# Altium schematic sheet Gate Driver.SchDoc
size A4; Author: Esteban Durán Madrid; CompanyName: Universidad de Santiago de Chile; Address1: Avenida Ecuador Nº 3519; Address2: Estación Central, Santiago; Address3: Chile
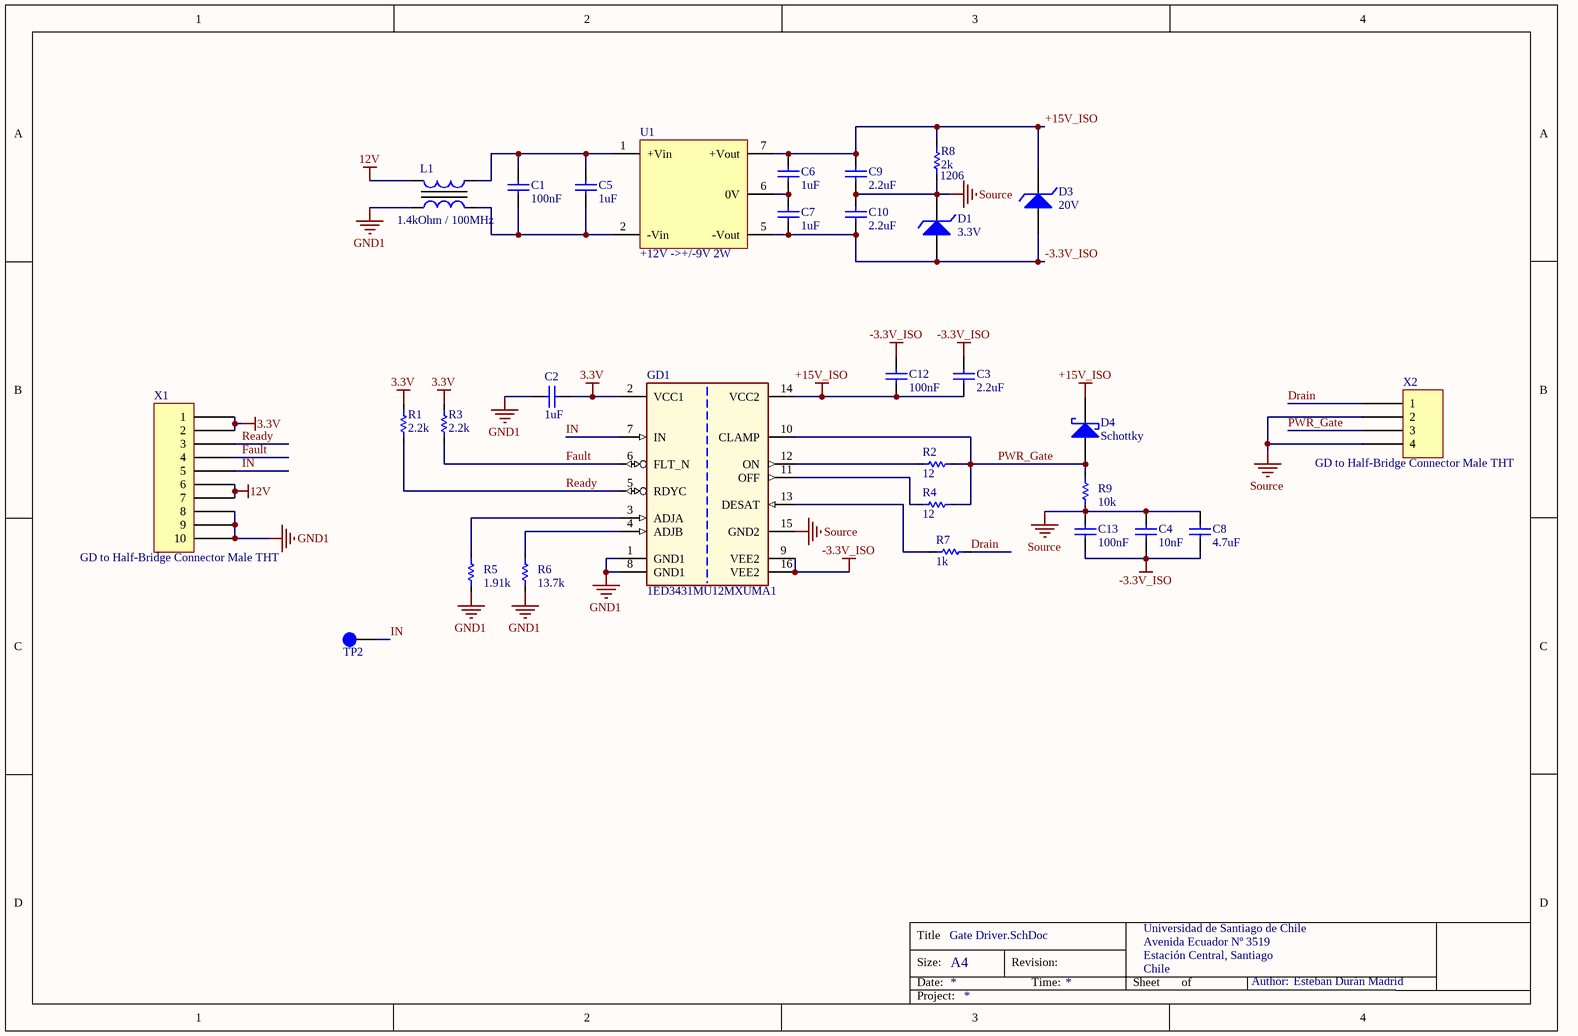
[diagram p0: Gate Driver.SchDoc]

## Parts
C1  100nF  [CAP_0603]
C2  1uF  [CAP_0805]
C3  2.2uF  [CAP_0805]
C4  10nF  [CAP_0603]
C5  1uF  [CAP_0805]
C6  1uF  [CAP_0805]
C7  1uF  [CAP_0805]
C8  4.7uF  [CAP_0805]
C9  2.2uF  [CAP_0805]
C10  2.2uF  [CAP_0805]
C12  100nF  [CAP_0603]
C13  100nF  [CAP_0603]
D1  3.3V  [SOD-123]
D3  20V  [SOD-123]
D4  Schottky  [SOD-123]
GD1  1ED3431MU12MXUMA1  [SOP65P1030X265-16N-1]
L1  1.4kOhm / 100MHz  [CHOKE_CM_4.7x4.5mm]
R1  2.2k  [RES_0603]
R2  12  [RES_MMB_0207]
R3  2.2k  [RES_0603]
R4  12  [RES_MMB_0207]
R5  1.91k  [RES_0603]
R6  13.7k  [RES_0603]
R7  1k  [RES_0603]
R8  2k  Package: 1206  [RES_1206]
R9  10k  [RES_0603]
TP2  Gate  [TP_1mm]  (value not drawn)  (no BOM)
U1  +12V ->+/-9V 2W  [DC//DC MEJ2D0509SC]
X1  GD to Half-Bridge Connector Male THT  [TMM-110-01-G-S]
X2  GD to Half-Bridge Connector Male THT  [TMM-104-01-G-S]

## Nets
3.3V: C2.1 GD1.2(VCC1) R1.2 R3.2 X1.1 X1.2
12V: L1.3 X1.6 X1.7
+15V_ISO: C3.2 C6.1 C9.1 C12.2 D3.K D4.K GD1.14(VCC2) R8.2 U1.7(+Vout)
-3.3V_ISO: C3.1 C4.2 C7.2 C8.2 C10.2 C12.1 C13.2 D1.A D3.A GD1.9(VEE2) GD1.16(VEE2) U1.5(-Vout)
GND1: C2.2 GD1.1(GND1) GD1.8(GND1) L1.4 R5.1 R6.1 X1.8 X1.9 X1.10
Source: C4.1 C8.1 C9.2 C10.1 C13.1 D1.K GD1.15(GND2) R8.1 R9.1 X2.2 X2.4
Drain: R7.2 X2.1
Fault: GD1.6(FLT_N) R3.1 X1.4
IN: GD1.7(IN) TP2.1 X1.5
PWR_Gate: D4.A GD1.10(CLAMP) R2.1 R4.1 R9.2 X2.3
Ready: GD1.5(RDYC) R1.1 X1.3
NetC1_1: C1.1 C5.2 L1.1 U1.2(-Vin)
NetC1_2: C1.2 C5.1 L1.2 U1.1(+Vin)
NetC6_2: C6.2 C7.1 U1.6(0V)
NetGD1_3: GD1.3(ADJA) R5.2
NetGD1_4: GD1.4(ADJB) R6.2
NetGD1_11: GD1.11(OFF) R4.2
NetGD1_12: GD1.12(ON) R2.2
NetGD1_13: GD1.13(DESAT) R7.1

## Notes on the sheet
- Title
- Size:
- Date:
- A4
- Revision:
- Time:
- Sheet
- of
- Author:
- Project:

## Library data of the parts
C1 C12 C13 = Cap_0603: 0.1µF ±10% 50V Ceramic Capacitor X7R 0603 (1608 Metric); MF: KEMET; MFP: C0603C104K5RACTU; Created: 2020_06_15_DAarancibia; Package: 0603; Value: 100nF; Supplier 1: Digi-Key; Supplier Part Number 1: 399-5089-1-ND
C2 C5-C7 = Cap_0805: 0.1µF ±10% 50V Ceramic Capacitor X7R 0805 (2012 Metric); MF: KEMET; MFP: C0805C105K5RACTU; Created: 2020_06_15_DAarancibia; Package: 0805; Value: 1uF; Supplier 1: Digi-Key; Supplier Part Number 1: 399-7409-1-ND
C3 = Cap_0805: 0.1µF ±10% 50V Ceramic Capacitor X7R 0805 (2012 Metric); MF: Taiyo Yuden; MFP: TMK212B7225MGHT; Created: 2020_06_15_DAarancibia; Package: 0805; Value: 2.2uF; Supplier 1: Digi-Key; Supplier Part Number 1: 587-6358-1-ND
C4 = Cap_0603: ±10% 50V Ceramic Capacitor X7R 0603 (1608 Metric); MF: KEMET; MFP: C0603C103K5RACTU; Created: 2020_06_15_DAarancibia; Package: 0603; Value: 10nF; Supplier 1: Digi-Key; Supplier Part Number 1: 399-1091-1-ND
C8 = Cap_0805: 4.7 µF ±10% 50V Ceramic Capacitor X7R 0805 (2012 Metric); MF: Murata Electronics; MFP: GRM21BZ71H475KE15L; Created: 2020_06_15_DAarancibia; Package: 0805; Value: 4.7uF; Supplier 1: Digi-Key; Supplier Part Number 1: 490-GRM21BZ71H475KE15LCT-ND
C9 C10 = Cap_0805: 2.2µF ±10% 50V Ceramic Capacitor X7R 0805 (2012 Metric); MF: KEMET; MFP: UMK212BB7225KG-T; Created: 2020_06_15_DAarancibia; Package: 0805; Value: 2.2uF; Supplier 1: Digi-Key; Supplier Part Number 1: 587-3169-1-ND
D1 = Diode_Zener_3.3V: Zener Diode 3.3V 500mW ±5% Surface Mount SOD-123; MF: ON Semiconductor; MFP: MMSZ5226BT1G; Created: 2020_07_28_DAarancibia; Package: SOD-123; Value: 3.3V; Supplier 1: Digi-Key; Supplier Part Number 1: MMSZ5226BT1GOSCT-ND
D3 = Diode_Zener_20V: Zener Diode 20V 500mW ±5% Surface Mount SOD-123; MF: Micro Commercial Co; MFP: MMSZ5250B-TP; Created: 2020_07_28_DAarancibia; Package: SOD-123; Value: 20V; Supplier 1: Digi-Key; Supplier Part Number 1: MMSZ5250B-TPMSCT-ND
D4 = Diode_Schottky_30V/1A: Diode Schottky 30 V 1A Surface Mount PG-SOD323-2; MF: Infineon Technologies; MFP: BAS3010B03WE6327HTSA1; Created: 2021_05_16_EDuran; Package: SC-76, SOD-323; Value: Schottky; Supplier 1: Digi-Key; Supplier Part Number 1: BAS3010B03WE6327HTSA1CT-ND
GD1 = 1ED3431MU12M: 3A Gate Driver Capacitive Coupling - Channel PG-DSO-16-28; MF: Infineon Technologies; Package: PG-DSO-16-28; MPN: 1ED3431MU12MXUMA1; Created: 2021_05_15_EDuran; Value: 1ED3431MU12MXUMA1; Supplier 1: Digi-Key; Supplier Part Number 1: 448-1ED3431MU12MXUMA1CT-ND
L1 = Choke_CM_ACM4520: 2 Line Common Mode Choke Surface Mount 1.4 kOhms @ 100MHz 1.7A DCR 80mOhm; MF: TDK Corporation; MFP: ACM4520-142-2P-T000; Created: 2020_07_28_DAarancibia; Package: 4.70mm x 4.50mm; Value: 1.4kOhm / 100MHz; Supplier 1: Digi-Key; Supplier Part Number 1: 445-6136-1-ND
R1 R3 = Res_0603: 2.2 kOhms ±5% 0.1W, 1/10W Chip Resistor 0603 (1608 Metric) Moisture Resistant Thick Film; MF: Bourns Inc.; MFP: CR0603-JW-222ELF; Created: 2020_06_15_DAarancibia; Package: 0603; Value: 2.2k; Supplier 1: Digi-Key; Supplier Part Number 1: CR0603-JW-222ELFCT-ND
R2 R4 = Res_MELF_0207: 12 Ohms ±1% 1W Chip Resistor MELF, 0207 Anti-Sulfur, Automotive AEC-Q200 Thin Film; MF: Vishay Beyschlag; MFP: MMB02070C1209FB200; Created: 2020_06_15_DAarancibia; Package: MELF 0207; Value: 12; Supplier 1: Digi-Key; Supplier Part Number 1: 749-1499-1-ND
R5 = Res_0603: 1.91 kOhms ±1% 0.1W, 1/10W Chip Resistor 0603 (1608 Metric) Moisture Resistant Thick Film; MF: Yageo; MFP: RC0603FR-071K91L; Created: 2020_06_15_DAarancibia; Package: 0603; Value: 1.91k; Supplier 1: Digi-Key; Supplier Part Number 1: 311-1.91KHRCT-ND
R6 = Res_0603: 13.7 kOhms ±1% 0.1W, 1/10W Chip Resistor 0603 (1608 Metric) Automotive AEC-Q200 Thick Film; MF: Stackpole Electronics Inc; MFP: RMCF0603FT13K7; Created: 2020_06_15_DAarancibia; Package: 0603; Value: 13.7k; Supplier 1: Digi-Key; Supplier Part Number 1: RMCF0603FT13K7CT-ND
R7 = Res_0603: 1 kOhms ±5% 0.25W, 1/4W Chip Resistor 0603 (1608 Metric) Automotive AEC-Q200, Pulse Withstanding Thick Film; MF: Yageo; MFP: SR0603JR-7T1KL; Created: 2020_06_15_DAarancibia; Package: 0603; Value: 1k; Supplier 1: Digi-Key; Supplier Part Number 1: YAG6166CT-ND
R8 = Res_1206: 2 kOhms ±0.1% 0.25W, 1/4W Chip Resistor 1206 (3216 Metric) - Thin Film; MF: Yageo; MFP: RT1206BRD072KL; Created: 2020_06_15_DAarancibia; Value: 2k; Supplier 1: Digi-Key; Supplier Part Number 1: YAG5062CT-ND
R9 = Res_0603: 10 kOhms ±5% 0.1W, 1/10W Chip Resistor 0603 (1608 Metric) Moisture Resistant Thick Film; MF: Yageo; MFP: RC0603JR-0710KP; Created: 2020_06_15_DAarancibia; Package: 0603; Value: 10k; Supplier 1: Digi-Key; Supplier Part Number 1: YAG1309CT-ND
TP2 = TP_1mm: Testpoint 1mm; Created: 2018_06_25_AGeiger; Value: Gate
U1 = DC//DC MEJ2D1209SC: Isolated Module DC DC Converter 2 Output 9V -9V - 111mA, 111mA 10.8V - 13.2V Input; MF: Murata Power Solutions Inc.; MPN: MEJ2D1209SC; Created: 2021_05_17_EDuran; Package: 7-SIP Module, 5 Leads; Value: +12V ->+/-9V 2W; Supplier 1: Digi-Key; Supplier Part Number 1: 811-2407-ND
X1 = Con_Header_Male_6: Connector Header Through Hole 10 position 0.079" (2.00mm); MF: Samtec Inc.; MPN: TMM-110-01-G-S; Created: 2021_05_24_EDuran; Package: Through Hole, pitch 0.079" (2.00mm); Value: GD to Half-Bridge Connector Male THT; Supplier 1: Digi-Key; Supplier Part Number 1: SAM1174-10-ND
X2 = Con_Header_Male_5: Connector Header Through Hole 4 position 0.079" (2.00mm); MF: Samtec Inc.; MPN: TMM-104-01-G-S; Created: 2021_05_24_EDuran; Package: Through Hole, pitch 0.079" (2.00mm); Value: GD to Half-Bridge Connector Male THT; Supplier 1: Digi-Key; Supplier Part Number 1: SAM1174-04-ND